# EAGLE schematic ccnor_stm32_v20 (EAGLE 6.1)
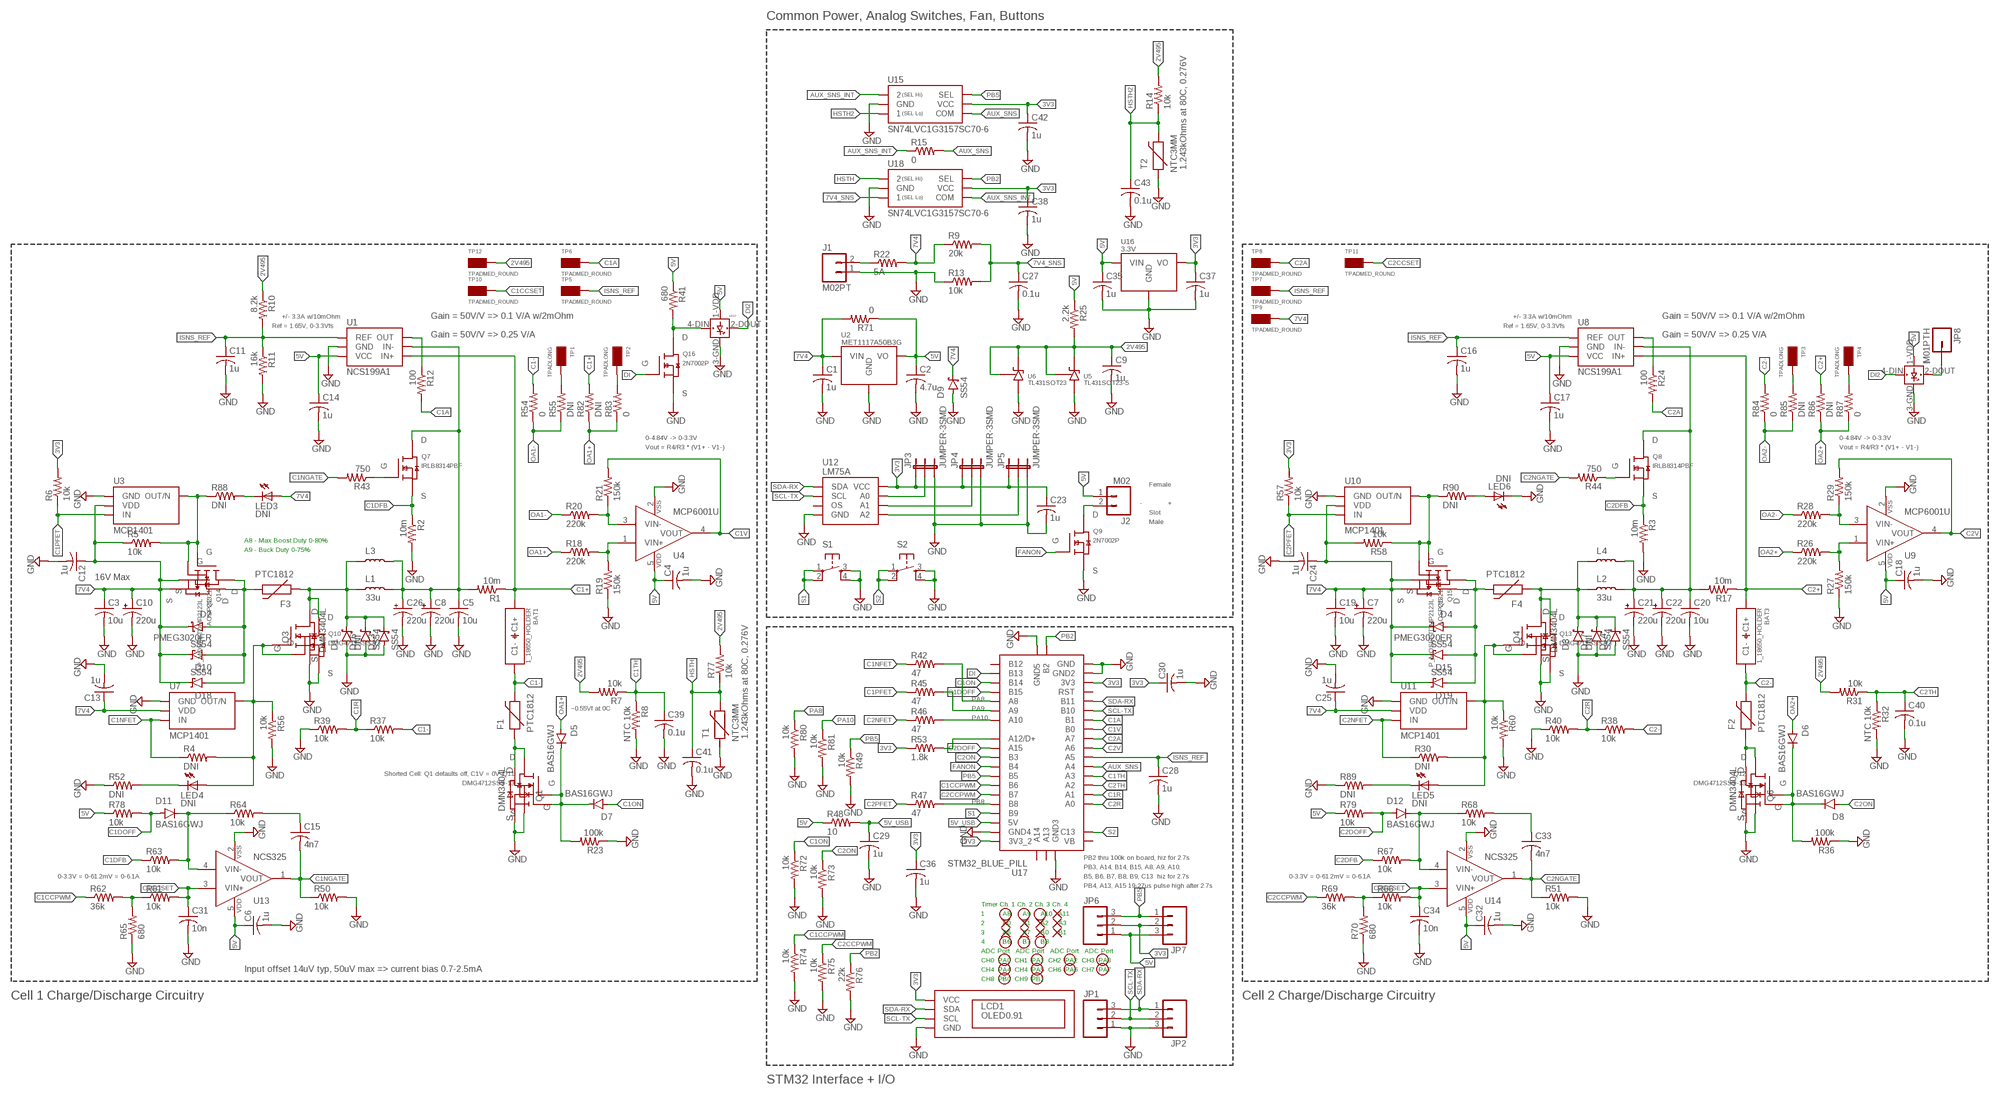
[diagram p0: schematic, sheet 1]

## Parts
BAT1  1_18650_HOLDER  [1S_18650_SMD_NH]
BAT3  1_18650_HOLDER  [1S_18650_SMD_NH]
C1  1u  C-USC0402  [C0402]
C2  4.7u  C-USC0402  [C0402]
C3  10u  C-USC1206  [C1206]
C4  1u  C-USC0402  [C0402]
C5  10u  C-USC1206  [C1206]
C6  1u  C-USC0402  [C0402]
C7  220u  CPOL-USD  [PANASONIC_D]
C8  220u  CPOL-USD  [PANASONIC_D]
C9  1u  C-USC0402  [C0402]
C10  220u  CPOL-USD  [PANASONIC_D]
C11  1u  C-USC0402  [C0402]
C12  1u  C-USC0402  [C0402]
C13  1u  C-USC0402  [C0402]
C14  1u  C-USC0402  [C0402]
C15  4n7  C-USC0402  [C0402]
C16  1u  C-USC0402  [C0402]
C17  1u  C-USC0402  [C0402]
C18  1u  C-USC0402  [C0402]
C19  10u  C-USC1206  [C1206]
C20  10u  C-USC1206  [C1206]
C21  220u  CPOL-USD  [PANASONIC_D]
C22  220u  CPOL-USD  [PANASONIC_D]
C23  1u  C-USC0402  [C0402]
C24  1u  C-USC0402  [C0402]
C25  1u  C-USC0402  [C0402]
C26  220u  CPOL-USD  [PANASONIC_D]
C27  0.1u  C-USC0402  [C0402]
C28  1u  C-USC0402  [C0402]
C29  1u  C-USC0402  [C0402]
C30  1u  C-USC0402  [C0402]
C31  10n  C-USC0402  [C0402]
C32  1u  C-USC0402  [C0402]
C33  4n7  C-USC0402  [C0402]
C34  10n  C-USC0402  [C0402]
C35  1u  C-USC0402  [C0402]
C36  1u  C-USC0402  [C0402]
C37  1u  C-USC0402  [C0402]
C38  1u  C-USC0402  [C0402]
C39  0.1u  C-USC0402  [C0402]
C40  0.1u  C-USC0402  [C0402]
C41  0.1u  C-USC0402  [C0402]
C42  1u  C-USC0402  [C0402]
C43  0.1u  C-USC0402  [C0402]
D1  DNI  PMEG3020ER  [SOD123W]
D2  PMEG3020ER  [SOD123W]
D3  DNI  PMEG3020ER  [SOD123W]
D4  PMEG3020ER  [SOD123W]
D5  BAS16GWJ  BAT60A  [SOD323]
D6  BAS16GWJ  BAT60A  [SOD323]
D7  BAS16GWJ  BAT60A  [SOD323]
D8  BAS16GWJ  BAT60A  [SOD323]
D9  SS54  [SMA]
D10  SS54  [SMA]
D11  BAS16GWJ  BAT60A  [SOD323]
D12  BAS16GWJ  BAT60A  [SOD323]
D13  SS54  [SMA]
D14  SS54  [SMA]
D15  SS54  [SMA]
D16  SS54  [SMA]
D17  SS54  [SMA]
D18  SS54  [SMA]
D19  SS54  [SMA]
F1  PTC1812  [1812]
F2  PTC1812  [1812]
F3  PTC1812  [1812]
F4  PTC1812  [1812]
J1  M02PT  [PHOENIXCONTACT1935161]
J2  M02  [B2B-XH-A]
JP1  M03PTH  [1X03]
JP2  M03PTH  [1X03]
JP3  JUMPER-3SMD  [SJ_3]
JP4  JUMPER-3SMD  [SJ_3]
JP5  JUMPER-3SMD  [SJ_3]
JP6  M03PTH  [1X03]
JP7  M03PTH  [1X03]
JP8  M01PTH  [1X01]
L1  33u  SDR1307  [INDUCTOR_SMD_13MM]
L2  33u  SDR1307  [INDUCTOR_SMD_13MM]
L3  INDUCTOR6A-LG  [INDUCTOR_6A_8MMX15MM]
L4  INDUCTOR6A-LG  [INDUCTOR_6A_8MMX15MM]
LCD1  OLED0.91  [OLED0.91]
LED3  DNI  LEDCHIPLED_0603  [CHIPLED_0603]
LED4  DNI  LEDCHIPLED_0603  [CHIPLED_0603]
LED5  DNI  LEDCHIPLED_0603  [CHIPLED_0603]
LED6  DNI  LEDCHIPLED_0603  [CHIPLED_0603]
LED7  WS2812B  [WS2812B]
LED8  WS2812B  [WS2812B]
Q1  DMN3404L  [SOT23]
Q2  P_MOSFETDMP2123L  [SOT23]
Q3  DMN3404L  [SOT23]
Q4  DMN3404L  [SOT23]
Q5  P_MOSFETDMP2123L  [SOT23]
Q6  DMN3404L  [SOT23]
Q7  IRLB8314PBF  [TO-220]
Q8  IRLB8314PBF  [TO-220]
Q9  2N7002P  [SOT23]
Q10  DMG4712SSS-13  N-MOSFET-SOIC8  [8-SOIC]
Q11  DMG4712SSS-13  N-MOSFET-SOIC8  [8-SOIC]
Q12  DMG4712SSS-13  N-MOSFET-SOIC8  [8-SOIC]
Q13  DMG4712SSS-13  N-MOSFET-SOIC8  [8-SOIC]
Q14  AOSP21321  P-MOSFET-SOIC8  [8-SOIC]
Q15  AOSP21321  P-MOSFET-SOIC8  [8-SOIC]
Q16  2N7002P  [SOT23]
R1  10m  R-US_R1206  [R1206]
R2  10m  R-US_R1206  [R1206]
R3  10m  R-US_R1206  [R1206]
R4  DNI  R-US_R0402  [R0402]
R5  10k  R-US_R0402  [R0402]
R6  10k  R-US_R0402  [R0402]
R7  10k  R-US_R0402  [R0402]
R8  NTC 10k  R-US_R0402  [R0402]
R9  20k  R-US_R0402  [R0402]
R10  8.2k  R-US_R0402  [R0402]
R11  16k  R-US_R0402  [R0402]
R12  100  R-US_R0402  [R0402]
R13  10k  R-US_R0402  [R0402]
R14  10k  R-US_R0402  [R0402]
R15  0  R-US_R0402  [R0402]
R17  10m  R-US_R1206  [R1206]
R18  220k  R-US_R0402  [R0402]
R19  150k  R-US_R0402  [R0402]
R20  220k  R-US_R0402  [R0402]
R21  150k  R-US_R0402  [R0402]
R22  5A  R-US_R1206  [R1206]
R23  100k  R-US_R0402  [R0402]
R24  100  R-US_R0402  [R0402]
R25  2.2k  R-US_R0402  [R0402]
R26  220k  R-US_R0402  [R0402]
R27  150k  R-US_R0402  [R0402]
R28  220k  R-US_R0402  [R0402]
R29  150k  R-US_R0402  [R0402]
R30  DNI  R-US_R0402  [R0402]
R31  10k  R-US_R0402  [R0402]
R32  NTC 10k  R-US_R0402  [R0402]
R36  100k  R-US_R0402  [R0402]
R37  10k  R-US_R0402  [R0402]
R38  10k  R-US_R0402  [R0402]
R39  10k  R-US_R0402  [R0402]
R40  10k  R-US_R0402  [R0402]
R41  680  R-US_R0402  [R0402]
R42  47  R-US_R0402  [R0402]
R43  750  R-US_R0402  [R0402]
R44  750  R-US_R0402  [R0402]
R45  47  R-US_R0402  [R0402]
R46  47  R-US_R0402  [R0402]
R47  47  R-US_R0402  [R0402]
R48  10  R-US_R0402  [R0402]
R49  10k  R-US_R0402  [R0402]
R50  10k  R-US_R0402  [R0402]
R51  10k  R-US_R0402  [R0402]
R52  DNI  R-US_R0402  [R0402]
R53  1.8k  R-US_R0402  [R0402]
R54  0  R-US_R0402  [R0402]
R55  DNI  R-US_R0402  [R0402]
R56  10k  R-US_R0402  [R0402]
R57  10k  R-US_R0402  [R0402]
R58  10k  R-US_R0402  [R0402]
R60  10k  R-US_R0402  [R0402]
R61  10k  R-US_R0402  [R0402]
R62  36k  R-US_R0402  [R0402]
R63  10k  R-US_R0402  [R0402]
R64  10k  R-US_R0402  [R0402]
R65  680  R-US_R0402  [R0402]
R66  10k  R-US_R0402  [R0402]
R67  10k  R-US_R0402  [R0402]
R68  10k  R-US_R0402  [R0402]
R69  36k  R-US_R0402  [R0402]
R70  680  R-US_R0402  [R0402]
R71  0  R-US_R0603  [R0603]
R72  10k  R-US_R0402  [R0402]
R73  10k  R-US_R0402  [R0402]
R74  10k  R-US_R0402  [R0402]
R75  10k  R-US_R0402  [R0402]
R76  22k  R-US_R0402  [R0402]
R77  10k  R-US_R0402  [R0402]
R78  10k  R-US_R0402  [R0402]
R79  10k  R-US_R0402  [R0402]
R80  10k  R-US_R0402  [R0402]
R81  10k  R-US_R0402  [R0402]
R82  DNI  R-US_R0402  [R0402]
R83  0  R-US_R0402  [R0402]
R84  0  R-US_R0402  [R0402]
R85  DNI  R-US_R0402  [R0402]
R86  DNI  R-US_R0402  [R0402]
R87  0  R-US_R0402  [R0402]
R88  DNI  R-US_R0402  [R0402]
R89  DNI  R-US_R0402  [R0402]
R90  DNI  R-US_R0402  [R0402]
S1  TAC_SWITCHSMD  [TACTILE_SWITCH_SMD]
S2  TAC_SWITCHSMD  [TACTILE_SWITCH_SMD]
T1  NTC3MM  PTCNTC3MM  [THERMISTOR_3MMX3MM]
T2  NTC3MM  PTCNTC3MM  [THERMISTOR_3MMX3MM]
TP1  TPADLONG  [TPAD_LONG]
TP2  TPADLONG  [TPAD_LONG]
TP3  TPADLONG  [TPAD_LONG]
TP4  TPADLONG  [TPAD_LONG]
TP5  TPADMED_ROUND  [TPAD_MED_ROUND]
TP6  TPADMED_ROUND  [TPAD_MED_ROUND]
TP7  TPADMED_ROUND  [TPAD_MED_ROUND]
TP8  TPADMED_ROUND  [TPAD_MED_ROUND]
TP9  TPADMED_ROUND  [TPAD_MED_ROUND]
TP10  TPADMED_ROUND  [TPAD_MED_ROUND]
TP11  TPADMED_ROUND  [TPAD_MED_ROUND]
TP12  TPADMED_ROUND  [TPAD_MED_ROUND]
U1  NCS199A1  INA214  [SOT-363]
U2  MET1117A50B3G  ZLDO1117  [TO-261]
U3  MCP1401  [SOT23-5]
U4  MCP6001U  [SOT23-5]
U5  TL431SOT23-5  [SOT23-5]
U6  TL431SOT23  [SOT23]
U7  MCP1401  [SOT23-5]
U8  NCS199A1  INA214  [SOT-363]
U9  MCP6001U  [SOT23-5]
U10  MCP1401  [SOT23-5]
U11  MCP1401  [SOT23-5]
U12  LM75A  [8-SOIC]
U13  NCS325  [SOT23-5]
U14  NCS325  [SOT23-5]
U15  SN74LVC1G3157SC70-6  [SC70-6]
U16  3.3V  AP1117UR133-B  [SOT-89]
U17  STM32_BLUE_PILL  [STM32_BLUE_PILL_USABLE]
U18  SN74LVC1G3157SC70-6  [SC70-6]

## Nets
2V495: C9.1 R7.2 R10.1 R14.2 R25.2 R31.2 R77.2 TP12.1 U5.3(K) U5.4(REF) U6.1(K) U6.2(REF)
3V3: C23.1 C30.1 C36.1 C37.1 C38.1 C42.1 JP3.1 JP4.1 JP5.1 JP6.2 JP7.2 LCD1.2-VCC(VCC) R6.2 R53.1 R57.2 U12.8(VCC) U15.5(VCC) U16.1(VO) U17.3V3 U17.3V3_2 U18.5(VCC)
5V: C2.1 C4.1 C6.1 C14.1 C17.1 C18.1 C32.1 C35.1 J2.1 JP6.1 JP7.3 LED7.1-VDD(VDD) LED8.1-VDD(VDD) R25.1 R41.1 R48.1 R71.1 R78.1 R79.1 U1.3(VCC) U2.2(VO) U2.4(VO) U4.5(VDD) U8.3(VCC) U9.5(VDD) U13.5(VDD) U14.5(VDD) U16.3(VIN)
5V_USB: C29.1 R48.2 U17.5V
7V4: C1.1 C3.1 C7.+ C10.+ C12.1 C13.1 C19.1 C24.1 C25.1 D2.K(CATHODE) D4.K(CATHODE) D9.K(CATHODE) D10.K(CATHODE) D15.K(CATHODE) D18.K(CATHODE) D19.K(CATHODE) LED3.A Q2.2(S) Q5.2(S) Q14.1(S) Q14.2(S) Q14.3(S) Q15.1(S) Q15.2(S) Q15.3(S) R5.1 R9.1 R22.2 R58.2 R71.2 TP9.1 U2.3(VIN) U3.2(VDD) U7.2(VDD) U10.2(VDD) U11.2(VDD)
7V4_SNS: C27.1 R9.2 R13.2 U18.3
AUX_SNS: R15.2 U15.4(COM) U17.A4
AUX_SNS_INT: R15.1 U15.1 U18.4(COM)
C1+: BAT1.1+(C1+) R1.1 R82.2 U1.4(IN+)
C1-: BAT1.1-(C1-) F1.2 R37.2 R54.2
C1_N: D1.K(CATHODE) D13.K(CATHODE) D16.K(CATHODE) F3.1 L1.1 L3.P$1 Q3.3(D) Q10.5(D) Q10.6(D) Q10.7(D) Q10.8(D)
C1_P-PTC: D2.A(ANODE) D10.A(ANODE) D18.A(ANODE) F3.2 Q2.3(D) Q14.5(D) Q14.6(D) Q14.7(D) Q14.8(D)
C1A: R12.2 TP6.1 U17.B1
C1CCPWM: R62.1 R74.1 U17.B6
C1CCSET: C31.1 R61.2 TP10.1 U13.3(VIN+)
C1DFB: Q7.3(S) R2.1 R63.1
C1DOFF: D11.A(ANODE) R78.2 U17.B15
C1NFET: R4.1 R42.1 U7.3(IN)
C1NGATE: C15.2 R43.2 R50.1 U13.1(VOUT)
C1ON: D7.A(ANODE) R72.1 U17.B14
C1PFET: R6.1 R45.1 U3.3(IN)
C1R: R37.1 R39.2 U17.A1
C1TH: C39.1 R7.1 R8.1 U17.A3
C1V: R21.2 U4.4(VOUT) U17.B0
C1VFBN: C15.1 R64.2
C1VFBN2: C33.1 R68.2
C2+: BAT3.1+(C1+) R17.1 R86.2 U8.4(IN+)
C2-: BAT3.1-(C1-) F2.2 R38.2 R84.2
C2_N: D3.K(CATHODE) D14.K(CATHODE) D17.K(CATHODE) F4.1 L2.1 L4.P$1 Q4.3(D) Q13.5(D) Q13.6(D) Q13.7(D) Q13.8(D)
C2_P_PTC: D4.A(ANODE) D15.A(ANODE) D19.A(ANODE) F4.2 Q5.3(D) Q15.5(D) Q15.6(D) Q15.7(D) Q15.8(D)
C2A: R24.2 TP8.1 U17.A7
C2CCPWM: R69.1 R75.1 U17.B7
C2CCSET: C34.1 R66.2 TP11.1 U14.3(VIN+)
C2DFB: Q8.3(S) R3.1 R67.1
C2DOFF: D12.A(ANODE) R79.2 U17.A15
C2NFET: R30.1 R46.1 U11.3(IN)
C2NGATE: C33.2 R44.2 R51.1 U14.1(VOUT)
C2ON: D8.A(ANODE) R73.1 U17.B3
C2PFET: R47.1 R57.1 U10.3(IN)
C2R: R38.1 R40.2 U17.A0
C2TH: C40.1 R31.1 R32.1 U17.A2
C2V: R29.2 U9.4(VOUT) U17.A6
DI: Q16.1(G) U17.B13
DI1: LED7.4-DIN(DIN) Q16.3(D) R41.2
DI2: LED7.2-DOUT(DOUT) LED8.4-DIN(DIN)
FANON: Q9.1(G) U17.B4
GND: C1.2 C2.2 C3.2 C4.2 C5.2 C6.2 C7.- C8.- C9.2 C10.- C11.2 C12.2 C13.2 C14.2 C16.2 C17.2 C18.2 C19.2 C20.2 C21.- C22.- C23.2 C24.2 C25.2 C26.- C27.2 C28.2 C29.2 C30.2 C31.2 C32.2 C34.2 C35.2 C36.2 C37.2 C38.2 C39.2 C40.2 C41.2 C42.2 C43.2 D1.A(ANODE) D3.A(ANODE) D9.A(ANODE) D13.A(ANODE) D14.A(ANODE) D16.A(ANODE) D17.A(ANODE) J1.1 JP1.1 JP2.3 JP3.3 JP4.3 JP5.3 LCD1.1=GND(GND) LED6.C LED7.3-GND(GND) LED8.3-GND(GND) Q1.2(S) Q3.2(S) Q4.2(S) Q6.2(S) Q9.2(S) Q10.1(S) Q10.2(S) Q10.3(S) Q11.1(S) Q11.2(S) Q11.3(S) Q12.1(S) Q12.2(S) Q12.3(S) Q13.1(S) Q13.2(S) Q13.3(S) Q16.2(S) R2.2 R3.2 R8.2 R11.2 R13.1 R19.1 R23.1 R27.1 R32.2 R36.1 R39.1 R40.1 R49.2 R50.2 R51.2 R52.1 R56.2 R60.2 R65.1 R70.1 R72.2 R73.2 R74.2 R75.2 R76.2 R80.2 R81.2 R89.1 S1.3 S1.4 S2.3 S2.4 T1.1 T2.1 U1.2(GND) U2.1(GND) U3.1(GND) U3.4(GND) U4.2(VSS) U5.2(A) U5.5(A) U6.3(A) U7.1(GND) U7.4(GND) U8.2(GND) U9.2(VSS) U10.1(GND) U10.4(GND) U11.1(GND) U11.4(GND) U12.4(GND) U13.2(VSS) U14.2(VSS) U15.2(GND) U16.2(GND) U16.2@1(GND) U17.GND U17.GND2 U17.GND3 U17.GND4 U17.GND5 U18.2(GND)
HSTH: C41.1 R77.1 T1.2 U18.1
HSTH2: C43.1 R14.1 T2.2 U15.3
I1-: C5.1 C8.+ C26.+ L1.2 L3.P$2 Q7.2(D) R1.2 U1.5(IN-)
I1-1: C20.1 C21.+ C22.+ L2.2 L4.P$2 Q8.2(D) R17.2 U8.5(IN-)
I1SET: R61.1 R62.2 R65.2
I1SET2: R66.1 R69.2 R70.2
IS1O: R12.1 U1.6(OUT)
IS1O1: R24.1 U8.6(OUT)
ISNS_REF: C11.1 C16.1 C28.1 R10.2 R11.1 TP5.1 TP7.1 U1.1(REF) U8.1(REF) U17.A5
N$1: LED3.C R88.2
N$2: F2.1 Q6.3(D) Q12.5(D) Q12.6(D) Q12.7(D) Q12.8(D)
N$3: R18.2 R19.2 U4.1(VIN+)
N$4: R20.2 R21.1 U4.3(VIN-)
N$5: R85.2 TP3.P$1
N$6: JP8.1 LED8.2-DOUT(DOUT)
N$7: D12.K(CATHODE) R67.2 R68.1 U14.4(VIN-)
N$13: J1.2 R22.1
N$14: D5.K(CATHODE) D7.K(CATHODE) Q1.1(G) Q11.4(G) R23.2
N$15: D6.K(CATHODE) D8.K(CATHODE) Q6.1(G) Q12.4(G) R36.2
N$16: R26.2 R27.2 U9.1(VIN+)
N$17: R28.2 R29.1 U9.3(VIN-)
N$19: R55.2 TP1.P$1
N$20: LED4.C R52.2
N$24: D11.K(CATHODE) R63.2 R64.1 U13.4(VIN-)
N$25: LED5.C R89.2
N$26: R53.2 U17.A12(A12/D+)
N$27: JP3.2 U12.7(A0)
N$28: JP4.2 U12.6(A1)
N$29: JP5.2 U12.5(A2)
N$30: R83.2 TP2.P$1
N$31: R87.2 TP4.P$1
N$32: F1.1 Q1.3(D) Q11.5(D) Q11.6(D) Q11.7(D) Q11.8(D)
N$33: LED6.A R90.2
N$34: J2.2 Q9.3(D)
NGATE1: LED4.A Q3.1(G) Q10.4(G) R4.2 R56.1 U7.5(OUT/N)
NGATE2: LED5.A Q4.1(G) Q13.4(G) R30.2 R60.1 U11.5(OUT/N)
OA1+: D5.A(ANODE) R18.1 R82.1 R83.1
OA1-: R20.1 R54.1 R55.1
OA2+: D6.A(ANODE) R26.1 R86.1 R87.1
OA2-: R28.1 R84.1 R85.1
PA8: R42.2 R80.1 U17.A8
PA9: R45.2 U17.A9
PA10: R46.2 R81.1 U17.A10
PB2: R76.1 U17.B2 U18.6(SEL)
PB5: JP6.3 JP7.1 R49.1 U15.6(SEL) U17.B5
PB8: R47.2 U17.B8
PGATE1: Q2.1(G) Q14.4(G) R5.2 R88.1 U3.5(OUT/N)
PGATE2: Q5.1(G) Q15.4(G) R58.1 R90.1 U10.5(OUT/N)
Q7G: Q7.1(G) R43.1
Q8G: Q8.1(G) R44.1
S1: S1.1 S1.2 U17.B9
S2: S2.1 S2.2 U17.C13
SCL-TX: JP1.2 JP2.2 LCD1.3=SCL(SCL) U12.2(SCL) U17.B10
SDA-RX: JP1.3 JP2.1 LCD1.4-SDA(SDA) U12.1(SDA) U17.B11
Unconnected: U12.3(OS) U17.B12 U17.DCLK(A14) U17.DIO(A13) U17.RST U17.VBAT(VB)

## Notes on the sheet
- Common Power, Analog Switches, Fan, Buttons
- 1.243kOhms at 80C, 0.276V
- +/- 3.3A w/10mOhm | Gain = 50V/V => 0.1 V/A w/2mOhm | +/- 3.3A w/10mOhm | Gain = 50V/V => 0.1 V/A w/2mOhm
- Ref = 1.65V, 0-3.3Vfs | Ref = 1.65V, 0-3.3Vfs
- Gain = 50V/V => 0.25 V/A | Gain = 50V/V => 0.25 V/A
- 0-4.84V -> 0-3.3V | 0-4.84V -> 0-3.3V
- Vout = R4/R3 * (V1+ - V1-) | Vout = R4/R3 * (V1+ - V1-)
- Female
- - | +
- Slot
- Male
- A8 - Max Boost Duty 0-80%
- A9 - Buck Duty 0-75%
- 16V Max
- ~0.55Vf at 0C
- 1.243kOhms at 80C, 0.276V
- Shorted Cell: Q1 defaults off, C1V = 0V
- PB2 thru 100k on board, hiz for 2.7s
- PB3, A14, B14, B15, A8, A9, A10,
- 0-3.3V = 0-61.2mV = 0-6.1A | B5, B6, B7, B8, B9, C13  hiz for 2.7s | 0-3.3V = 0-61.2mV = 0-6.1A
- PB4, A13, A15 19-27us pulse high after 2.7s
- Timer Ch. 1 Ch. 2 Ch. 3 Ch. 4
- 1         A8      A9     A10   A11
- 2         A0      A1     A2     A3
- 3         A6      A7     B0     B1
- 4         B6      B7     B8
- ADC Port   ADC Port   ADC Port   ADC Port
- CH0  PA0  CH1  PA1  CH2  PA2  CH3  PA3
- Input offset 14uV typ, 50uV max => current bias 0.7-2.5mA | CH4  PA4  CH4  PA5  CH6  PA6  CH7  PA7
- CH8  PB0  CH9  PB1
- Cell 1 Charge/Discharge Circuitry | Cell 2 Charge/Discharge Circuitry
- STM32 Interface + I/O

## Library data of the parts
BAT1 BAT3 = custom:1_18650_HOLDER
C1-C6 C9 C11-C20 C23-C25 C27-C43 = resistor:C-US: CAPACITOR, American symbol
C7 C8 C10 C21 C22 C26 = resistor:CPOL-US: POLARIZED CAPACITOR, American symbol
D1-D4 = custom:PMEG3020ER: Schottky Diode 30V 2A 0.42V 1.5mA Leakage
D5-D8 D11 D12 = custom:BAT60A: Schottky Diode 10V 3A 0.37V at 1A
D9 D10 D13-D19 = custom:SS54: Diode Schottky 40V 5A 1mA Ir 0.55Vf
F1-F4 T1 T2 = custom:PTC
J1 J2 = custom:M02
JP1 JP2 JP6 JP7 = SparkFun:M03: Header 3 Standard 3-pin 0.1" header. Use with straight break away headers (SKU : PRT-00116), right angle break away headers (PRT-00553), swiss pins (PRT-00743), machine pins (PRT-00117), and female headers (PRT-00115). Molex polarized connector foot print use with SKU : PRT-08232 with associated crimp pins and housings.
JP3-JP5 = SparkFun:JUMPER-3
JP8 = SparkFun:M01: Header 1 Standard 1-pin 0.1" header. Use with straight break away headers (SKU : PRT-00116), right angle break away headers (PRT-00553), swiss pins (PRT-00743), machine pins (PRT-00117), and female headers (PRT-00115).
L1 L2 = custom:SDR1307
L3 L4 = custom:INDUCTOR
LCD1 = custom:OLED0.91
LED3-LED6 = led:LED: LED OSRAM: - CHIPLED LG R971, LG N971, LY N971, LG Q971, LY Q971, LO R971, LY R971 LH N974, LH R974 LS Q976, LO Q976, LY Q976 LO Q996 - Hyper CHIPLED LW Q18S LB Q993, LB Q99A, LB R99A - SideLED LS A670, LO A670, LY A670, LG A670, LP A670 LB A673, LV A673, LT A673, LW A673 LH A674 LY A675 LS A676, LA A676, LO A676, LY A676, LW A676 LS A679, LY A679, LG A679 - Hyper Micro SIDELED® LS Y876, LA Y876, LO Y876, LY Y876 LT Y87S - SmartLED LW L88C, LW L88S LB L89C, LB L89S, LG L890 LS L89K, LO L89K, LY L89K LS L896, LA L896, LO L896, LY L896 - TOPLED LS T670, LO T670, LY T670, LG T670, LP T670 LSG T670, LSP T670, LSY T670, LOP T670, LYG T670 LG T671, LOG T671, LSG T671 LB T673, LV T673, LT T673, LW T673 LH T674 LS T676, LA T676, LO T676, LY T676, LB T676, LH T676, LSB T676, LW T676 LB T67C, LV T67C, LT T67C, LS T67K, LO T67K, LY T67K, LW E67C LS E67B, LA E67B, LO E67B, LY E67B, LB E67C, LV E67C, LT E67C LW T67C LS T679, LY T679, LG T679 LS T770, LO T770, LY T770, LG T770, LP T770 LB T773, LV T773, LT T773, LW T773 LH T774 LS E675, LA E675, LY E675, LS T675 LS T776, LA T776, LO T776, LY T776, LB T776 LHGB T686 LT T68C, LB T68C - Hyper Mini TOPLED® LB M676 - Mini TOPLED Santana® LG M470 LS M47K, LO M47K, LY M47K Source: http://www.osram.convergy.de LUXEON: - LUMILED® LXK2-PW12-R00, LXK2-PW12-S00, LXK2-PW14-U00, LXK2-PW14-V00 LXK2-PM12-R00, LXK2-PM12-S00, LXK2-PM14-U00 LXK2-PE12-Q00, LXK2-PE12-R00, LXK2-PE12-S00, LXK2-PE14-T00, LXK2-PE14-U00 LXK2-PB12-K00, LXK2-PB12-L00, LXK2-PB12-M00, LXK2-PB14-N00, LXK2-PB14-P00, LXK2-PB14-Q00 LXK2-PR12-L00, LXK2-PR12-M00, LXK2-PR14-Q00, LXK2-PR14-R00 LXK2-PD12-Q00, LXK2-PD12-R00, LXK2-PD12-S00 LXK2-PH12-R00, LXK2-PH12-S00 LXK2-PL12-P00, LXK2-PL12-Q00, LXK2-PL12-R00 Source: www.luxeon.com KINGBRIGHT: KA-3528ASYC Source: www.kingbright.com
LED7 LED8 = adafruit:WS2812B
Q1 Q3 Q4 Q6 = custom:DMN3404L: N-Channel MOSFET 30V 5.8A 28mOhm Logic Level
Q2 Q5 = custom:P_MOSFET
Q7 Q8 = custom:IRLB8314PBF: MOSFET N-Channel 30V 184A 3.2mOhm @4.5Vgs 125W
Q9 Q16 = custom:2N7002P: 2N7002P N-channel MOSFET 60V 360mA Logic Level
Q10-Q13 = custom:N-MOSFET-SOIC8
Q14 Q15 = custom:P-MOSFET-SOIC8
R1-R15 R17-R32 R36-R58 R60-R90 = resistor:R-US_: RESISTOR, American symbol
S1 S2 = SparkFun:TAC_SWITCH: Momentary Switch Button commonly used for reset or general input. Spark Fun Electronics SKU : COM-00097
TP1-TP12 = custom:TPAD
U1 U8 = custom:INA214: Current Shunt Amplifier 30kHz 2.7-26V
U2 = custom:ZLDO1117: Linear Regulator 18V Max 1A 10mA
U3 U7 U10 U11 = custom:MCP1401: 500mA MOSFET gate driver 4.5-18V, 3V input. 1402 = Non-inverting, 1401 = Inverting
U4 U9 = custom:MCP6001: Op-Amp Single Rail-to-Rail 1MHz
U5 U6 = custom:TL431: Shunt Voltage Reference IC 700uA 100mA 36V
U12 = custom:LM75A: I2C Temperature Sensor -55 to 125 C 11b 8-SOIC
U13 U14 = custom:NCS325
U15 U18 = custom:SN74LVC1G3157: Single Analog Mux IC Switch 2:1 15 Ohm 1.65-5.5V
U16 = custom:AP1117: Linear Voltage Regulator 18V Max 1A
U17 = custom:STM32_BLUE_PILL